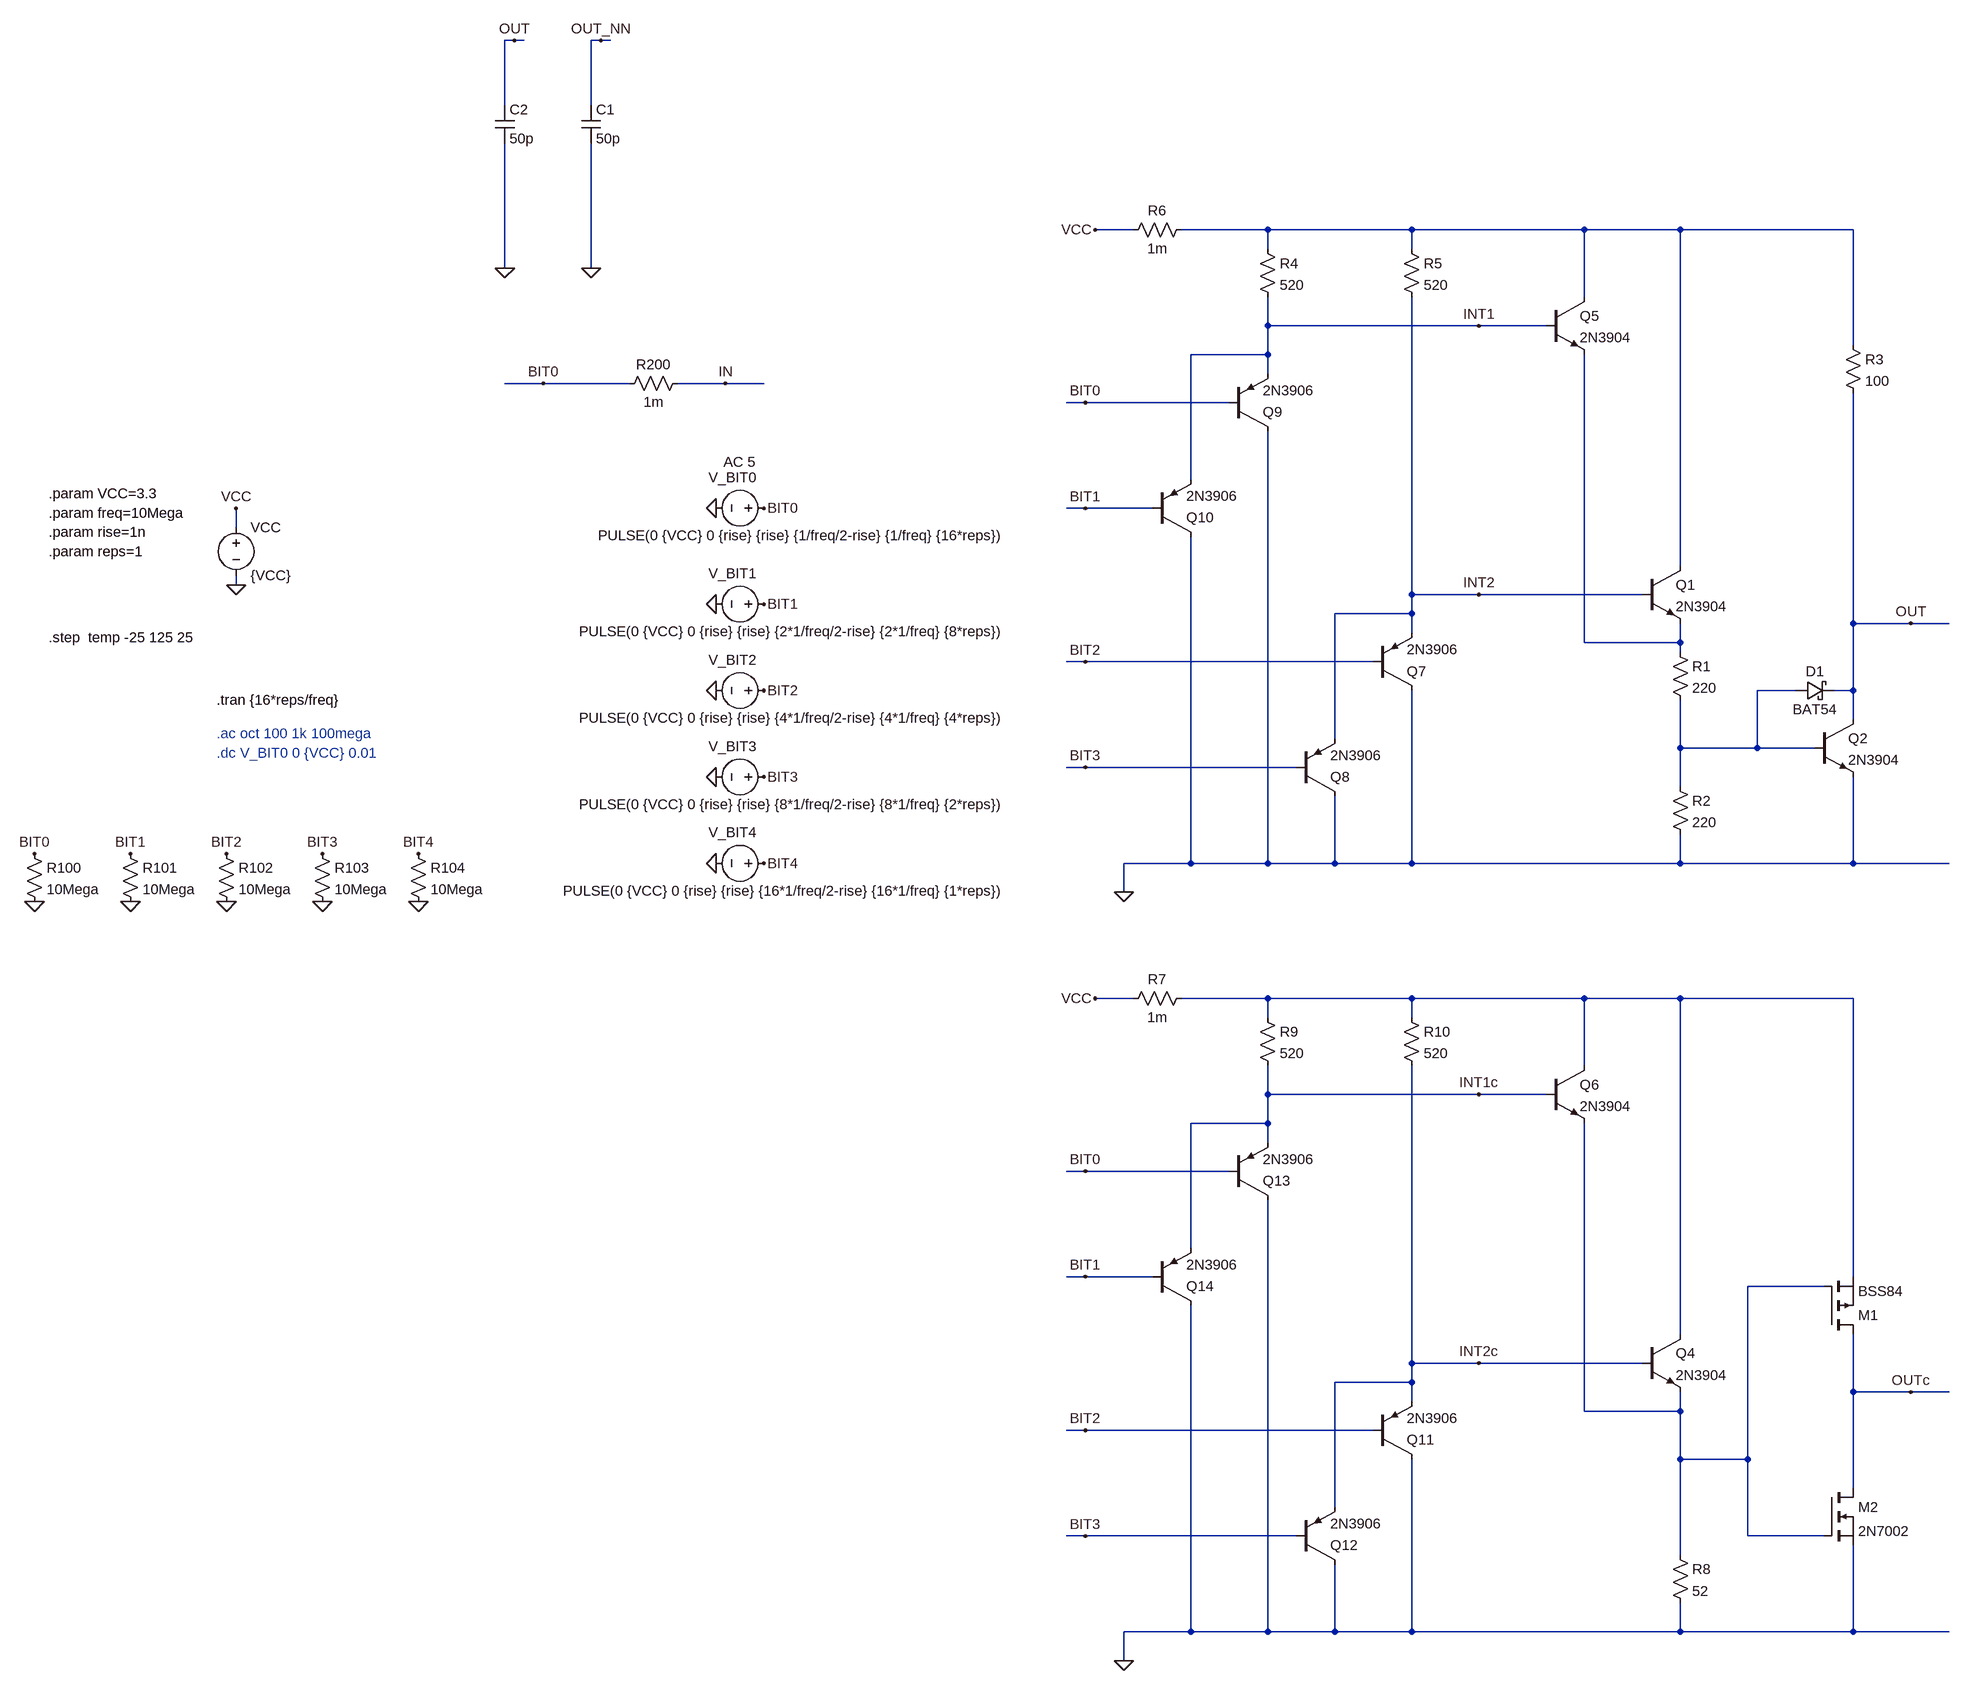
[diagram p0: schematic aoi.asc]
aoi.asc, the LTspice schematic file:
Version 4.1
SHEET 1 14868 10612
WIRE -288 80 -304 80
WIRE -272 80 -288 80
WIRE -144 80 -160 80
WIRE -128 80 -144 80
WIRE -304 208 -304 80
WIRE -160 208 -160 80
WIRE 1984 416 1920 416
WIRE 2208 416 2064 416
WIRE 2448 416 2208 416
WIRE 2736 416 2448 416
WIRE 2896 416 2736 416
WIRE 3184 416 2896 416
WIRE 2208 448 2208 416
WIRE 2448 448 2448 416
WIRE -304 480 -304 272
WIRE -160 480 -160 272
WIRE 2736 528 2736 416
WIRE 2208 576 2208 528
WIRE 2560 576 2208 576
WIRE 2672 576 2560 576
WIRE 3184 608 3184 416
WIRE 2208 624 2208 576
WIRE 2208 624 2080 624
WIRE 2208 656 2208 624
WIRE -240 672 -304 672
WIRE -96 672 -240 672
WIRE 64 672 -16 672
WIRE 128 672 64 672
WIRE 1904 704 1872 704
WIRE 2144 704 1904 704
WIRE 2080 832 2080 624
WIRE 1904 880 1872 880
WIRE 2016 880 1904 880
WIRE -752 912 -752 880
WIRE 2896 976 2896 416
WIRE -752 1008 -752 992
WIRE 2448 1024 2448 528
WIRE 2560 1024 2448 1024
WIRE 2832 1024 2560 1024
WIRE 2448 1056 2448 1024
WIRE 2448 1056 2320 1056
WIRE 3184 1072 3184 688
WIRE 3280 1072 3184 1072
WIRE 3344 1072 3280 1072
WIRE 2448 1088 2448 1056
WIRE 2736 1104 2736 624
WIRE 2896 1104 2896 1072
WIRE 2896 1104 2736 1104
WIRE 2896 1120 2896 1104
WIRE 1904 1136 1872 1136
WIRE 2384 1136 1904 1136
WIRE 3088 1184 3024 1184
WIRE 3184 1184 3184 1072
WIRE 3184 1184 3152 1184
WIRE 3184 1232 3184 1184
WIRE 2320 1264 2320 1056
WIRE 2896 1280 2896 1200
WIRE 3024 1280 3024 1184
WIRE 3024 1280 2896 1280
WIRE 3120 1280 3024 1280
WIRE 1904 1312 1872 1312
WIRE 2256 1312 1904 1312
WIRE 2896 1344 2896 1280
WIRE 2080 1472 2080 928
WIRE 2080 1472 1968 1472
WIRE 2208 1472 2208 752
WIRE 2208 1472 2080 1472
WIRE 2320 1472 2320 1360
WIRE 2320 1472 2208 1472
WIRE 2448 1472 2448 1184
WIRE 2448 1472 2320 1472
WIRE 2896 1472 2896 1424
WIRE 2896 1472 2448 1472
WIRE 3184 1472 3184 1328
WIRE 3184 1472 2896 1472
WIRE 3344 1472 3184 1472
WIRE 1968 1520 1968 1472
WIRE 1984 1824 1920 1824
WIRE 2208 1824 2064 1824
WIRE 2448 1824 2208 1824
WIRE 2736 1824 2448 1824
WIRE 2896 1824 2736 1824
WIRE 3184 1824 2896 1824
WIRE 2208 1856 2208 1824
WIRE 2448 1856 2448 1824
WIRE 2736 1936 2736 1824
WIRE 2208 1984 2208 1936
WIRE 2560 1984 2208 1984
WIRE 2672 1984 2560 1984
WIRE 2208 2032 2208 1984
WIRE 2208 2032 2080 2032
WIRE 2208 2064 2208 2032
WIRE 1904 2112 1872 2112
WIRE 2144 2112 1904 2112
WIRE 2080 2240 2080 2032
WIRE 1904 2288 1872 2288
WIRE 2016 2288 1904 2288
WIRE 3184 2288 3184 1824
WIRE 3136 2304 3008 2304
WIRE 2896 2384 2896 1824
WIRE 2448 2432 2448 1936
WIRE 2560 2432 2448 2432
WIRE 2832 2432 2560 2432
WIRE 2448 2464 2448 2432
WIRE 2448 2464 2320 2464
WIRE 3184 2480 3184 2384
WIRE 3280 2480 3184 2480
WIRE 3344 2480 3280 2480
WIRE 2448 2496 2448 2464
WIRE 2736 2512 2736 2032
WIRE 2896 2512 2896 2480
WIRE 2896 2512 2736 2512
WIRE 1904 2544 1872 2544
WIRE 2384 2544 1904 2544
WIRE 2896 2592 2896 2512
WIRE 3008 2592 3008 2304
WIRE 3008 2592 2896 2592
WIRE 3184 2640 3184 2480
WIRE 2320 2672 2320 2464
WIRE 1904 2720 1872 2720
WIRE 2256 2720 1904 2720
WIRE 3008 2720 3008 2592
WIRE 3136 2720 3008 2720
WIRE 2896 2752 2896 2592
WIRE 2080 2880 2080 2336
WIRE 2080 2880 1968 2880
WIRE 2208 2880 2208 2160
WIRE 2208 2880 2080 2880
WIRE 2320 2880 2320 2768
WIRE 2320 2880 2208 2880
WIRE 2448 2880 2448 2592
WIRE 2448 2880 2320 2880
WIRE 2896 2880 2896 2832
WIRE 2896 2880 2448 2880
WIRE 3184 2880 3184 2736
WIRE 3184 2880 2896 2880
WIRE 3344 2880 3184 2880
WIRE 1968 2928 1968 2880
FLAG -752 1008 0
FLAG 128 880 BIT0
FLAG -752 880 VCC
FLAG 48 880 0
FLAG 128 1040 BIT1
FLAG 48 1040 0
FLAG 128 1184 BIT2
FLAG 48 1184 0
FLAG 128 1328 BIT3
FLAG 48 1328 0
FLAG 128 1472 BIT4
FLAG 48 1472 0
FLAG -1088 1456 BIT0
FLAG -1088 1536 0
FLAG -928 1456 BIT1
FLAG -928 1536 0
FLAG -768 1456 BIT2
FLAG -768 1536 0
FLAG -608 1456 BIT3
FLAG -608 1536 0
FLAG -448 1456 BIT4
FLAG -448 1536 0
FLAG 3280 1072 OUT
FLAG 2560 1024 INT2
FLAG 1920 416 VCC
FLAG -240 672 BIT0
FLAG 64 672 IN
FLAG 2560 576 INT1
FLAG -288 80 OUT
FLAG -304 480 0
FLAG 1904 1136 BIT2
FLAG 1904 1312 BIT3
FLAG 1968 1520 0
FLAG 1904 704 BIT0
FLAG 1904 880 BIT1
FLAG -144 80 OUT_NN
FLAG -160 480 0
FLAG 3280 2480 OUTc
FLAG 2560 2432 INT2c
FLAG 1920 1824 VCC
FLAG 2560 1984 INT1c
FLAG 1904 2544 BIT2
FLAG 1904 2720 BIT3
FLAG 1968 2928 0
FLAG 1904 2112 BIT0
FLAG 1904 2288 BIT1
SYMBOL voltage -752 896 R0
WINDOW 123 0 0 Left 0
WINDOW 39 0 0 Left 0
SYMATTR InstName VCC
SYMATTR Value {VCC}
SYMBOL voltage 144 880 R90
WINDOW 123 -77 30 VRight 2
WINDOW 39 0 0 Left 0
WINDOW 0 -51 28 VRight 2
WINDOW 3 46 -379 VRight 2
SYMATTR Value2 AC 5
SYMATTR InstName V_BIT0
SYMATTR Value PULSE(0 {VCC} 0 {rise} {rise} {1/freq/2-rise} {1/freq} {16*reps})
SYMBOL voltage 144 1040 R90
WINDOW 123 -77 30 VRight 2
WINDOW 39 0 0 Left 0
WINDOW 0 -51 28 VRight 2
WINDOW 3 46 -379 VRight 2
SYMATTR InstName V_BIT1
SYMATTR Value PULSE(0 {VCC} 0 {rise} {rise} {2*1/freq/2-rise} {2*1/freq} {8*reps})
SYMBOL voltage 144 1184 R90
WINDOW 123 -77 30 VRight 2
WINDOW 39 0 0 Left 0
WINDOW 0 -51 28 VRight 2
WINDOW 3 46 -379 VRight 2
SYMATTR InstName V_BIT2
SYMATTR Value PULSE(0 {VCC} 0 {rise} {rise} {4*1/freq/2-rise} {4*1/freq} {4*reps})
SYMBOL voltage 144 1328 R90
WINDOW 123 -77 30 VRight 2
WINDOW 39 0 0 Left 0
WINDOW 0 -51 28 VRight 2
WINDOW 3 46 -379 VRight 2
SYMATTR InstName V_BIT3
SYMATTR Value PULSE(0 {VCC} 0 {rise} {rise} {8*1/freq/2-rise} {8*1/freq} {2*reps})
SYMBOL voltage 144 1472 R90
WINDOW 123 -77 30 VRight 2
WINDOW 39 0 0 Left 0
WINDOW 0 -51 28 VRight 2
WINDOW 3 46 -379 VRight 2
SYMATTR InstName V_BIT4
SYMATTR Value PULSE(0 {VCC} 0 {rise} {rise} {16*1/freq/2-rise} {16*1/freq} {1*reps})
SYMBOL res -1104 1440 R0
SYMATTR InstName R100
SYMATTR Value 10Mega
SYMBOL res -944 1440 R0
SYMATTR InstName R101
SYMATTR Value 10Mega
SYMBOL res -784 1440 R0
SYMATTR InstName R102
SYMATTR Value 10Mega
SYMBOL res -624 1440 R0
SYMATTR InstName R103
SYMATTR Value 10Mega
SYMBOL res -464 1440 R0
SYMATTR InstName R104
SYMATTR Value 10Mega
SYMBOL npn 3120 1232 R0
SYMATTR InstName Q2
SYMATTR Value 2N3904
SYMBOL schottky 3088 1200 R270
WINDOW 0 32 32 VTop 2
WINDOW 3 0 32 VBottom 2
SYMATTR InstName D1
SYMATTR Value BAT54
SYMATTR Description Diode
SYMATTR Type diode
SYMBOL npn 2832 976 R0
SYMATTR InstName Q1
SYMATTR Value 2N3904
SYMBOL res 3168 592 R0
SYMATTR InstName R3
SYMATTR Value 100
SYMBOL res 2880 1104 R0
SYMATTR InstName R1
SYMATTR Value 220
SYMBOL res 2880 1328 R0
SYMATTR InstName R2
SYMATTR Value 220
SYMBOL res 0 656 R90
WINDOW 0 0 56 VBottom 2
WINDOW 3 32 56 VTop 2
SYMATTR InstName R200
SYMATTR Value 1m
SYMBOL cap -320 208 R0
SYMATTR InstName C2
SYMATTR Value 50p
SYMBOL npn 2672 528 R0
SYMATTR InstName Q5
SYMATTR Value 2N3904
SYMBOL pnp 2384 1184 M180
SYMATTR InstName Q7
SYMATTR Value 2N3906
SYMBOL pnp 2256 1360 M180
SYMATTR InstName Q8
SYMATTR Value 2N3906
SYMBOL pnp 2144 752 M180
SYMATTR InstName Q9
SYMATTR Value 2N3906
SYMBOL pnp 2016 928 M180
SYMATTR InstName Q10
SYMATTR Value 2N3906
SYMBOL res 2192 432 R0
SYMATTR InstName R4
SYMATTR Value 520
SYMBOL res 2432 432 R0
SYMATTR InstName R5
SYMATTR Value 520
SYMBOL cap -176 208 R0
SYMATTR InstName C1
SYMATTR Value 50p
SYMBOL npn 2832 2384 R0
SYMATTR InstName Q4
SYMATTR Value 2N3904
SYMBOL res 2880 2736 R0
SYMATTR InstName R8
SYMATTR Value 52
SYMBOL npn 2672 1936 R0
SYMATTR InstName Q6
SYMATTR Value 2N3904
SYMBOL pnp 2384 2592 M180
SYMATTR InstName Q11
SYMATTR Value 2N3906
SYMBOL pnp 2256 2768 M180
SYMATTR InstName Q12
SYMATTR Value 2N3906
SYMBOL pnp 2144 2160 M180
SYMATTR InstName Q13
SYMATTR Value 2N3906
SYMBOL pnp 2016 2336 M180
SYMATTR InstName Q14
SYMATTR Value 2N3906
SYMBOL res 2192 1840 R0
SYMATTR InstName R9
SYMATTR Value 520
SYMBOL res 2432 1840 R0
SYMATTR InstName R10
SYMATTR Value 520
SYMBOL pmos 3136 2384 M180
SYMATTR InstName M1
SYMATTR Value BSS84
SYMBOL nmos 3136 2640 R0
SYMATTR InstName M2
SYMATTR Value 2N7002
SYMBOL res 1968 432 R270
WINDOW 0 32 56 VTop 2
WINDOW 3 0 56 VBottom 2
SYMATTR InstName R6
SYMATTR Value 1m
SYMBOL res 1968 1840 R270
WINDOW 0 32 56 VTop 2
WINDOW 3 0 56 VBottom 2
SYMATTR InstName R7
SYMATTR Value 1m
TEXT -784 1200 Left 2 !.tran {16*reps/freq}
TEXT -784 1256 Left 2 ;.ac oct 100 1k 100mega
TEXT -784 1288 Left 2 ;.dc V_BIT0 0 {VCC} 0.01
TEXT -1064 856 Left 2 !.param VCC=3.3
TEXT -1064 888 Left 2 !.param freq=10Mega
TEXT -1064 920 Left 2 !.param rise=1n
TEXT -1064 952 Left 2 !.param reps=1
TEXT -1064 1096 Left 2 !.step  temp -25 125 25

The netlist it stands for:
* aoi.asc
VCC VCC 0 {VCC}
V_BIT0 BIT0 0 PULSE(0 {VCC} 0 {rise} {rise} {1/freq/2-rise} {1/freq} {16*reps}) AC 5
V_BIT1 BIT1 0 PULSE(0 {VCC} 0 {rise} {rise} {2*1/freq/2-rise} {2*1/freq} {8*reps})
V_BIT2 BIT2 0 PULSE(0 {VCC} 0 {rise} {rise} {4*1/freq/2-rise} {4*1/freq} {4*reps})
V_BIT3 BIT3 0 PULSE(0 {VCC} 0 {rise} {rise} {8*1/freq/2-rise} {8*1/freq} {2*reps})
V_BIT4 BIT4 0 PULSE(0 {VCC} 0 {rise} {rise} {16*1/freq/2-rise} {16*1/freq} {1*reps})
R100 BIT0 0 10Mega
R101 BIT1 0 10Mega
R102 BIT2 0 10Mega
R103 BIT3 0 10Mega
R104 BIT4 0 10Mega
Q2 OUT N003 0 0 2N3904
D1 N003 OUT BAT54
Q1 N001 INT2 N002 0 2N3904
R3 N001 OUT 100
R1 N002 N003 220
R2 N003 0 220
R200 IN BIT0 1m
C2 OUT 0 50p
Q5 N001 INT1 N002 0 2N3904
Q7 0 BIT2 INT2 0 2N3906
Q8 0 BIT3 INT2 0 2N3906
Q9 0 BIT0 INT1 0 2N3906
Q10 0 BIT1 INT1 0 2N3906
R4 N001 INT1 520
R5 N001 INT2 520
C1 OUT_NN 0 50p
Q4 N004 INT2c N005 0 2N3904
R8 N005 0 52
Q6 N004 INT1c N005 0 2N3904
Q11 0 BIT2 INT2c 0 2N3906
Q12 0 BIT3 INT2c 0 2N3906
Q13 0 BIT0 INT1c 0 2N3906
Q14 0 BIT1 INT1c 0 2N3906
R9 N004 INT1c 520
R10 N004 INT2c 520
M1 OUTc N005 N004 N004 BSS84
M2 OUTc N005 0 0 2N7002
R6 VCC N001 1m
R7 VCC N004 1m
.model D D
.lib standard.dio
.model NPN NPN
.model PNP PNP
.lib standard.bjt
.model NMOS NMOS
.model PMOS PMOS
.lib standard.mos
.tran {16*reps/freq}
* .ac oct 100 1k 100mega
* .dc V_BIT0 0 {VCC} 0.01
.param VCC=3.3
.param freq=10Mega
.param rise=1n
.param reps=1
.step  temp -25 125 25
.backanno
.end